# EAGLE design 237_thermopile (EAGLE 9.6.2)
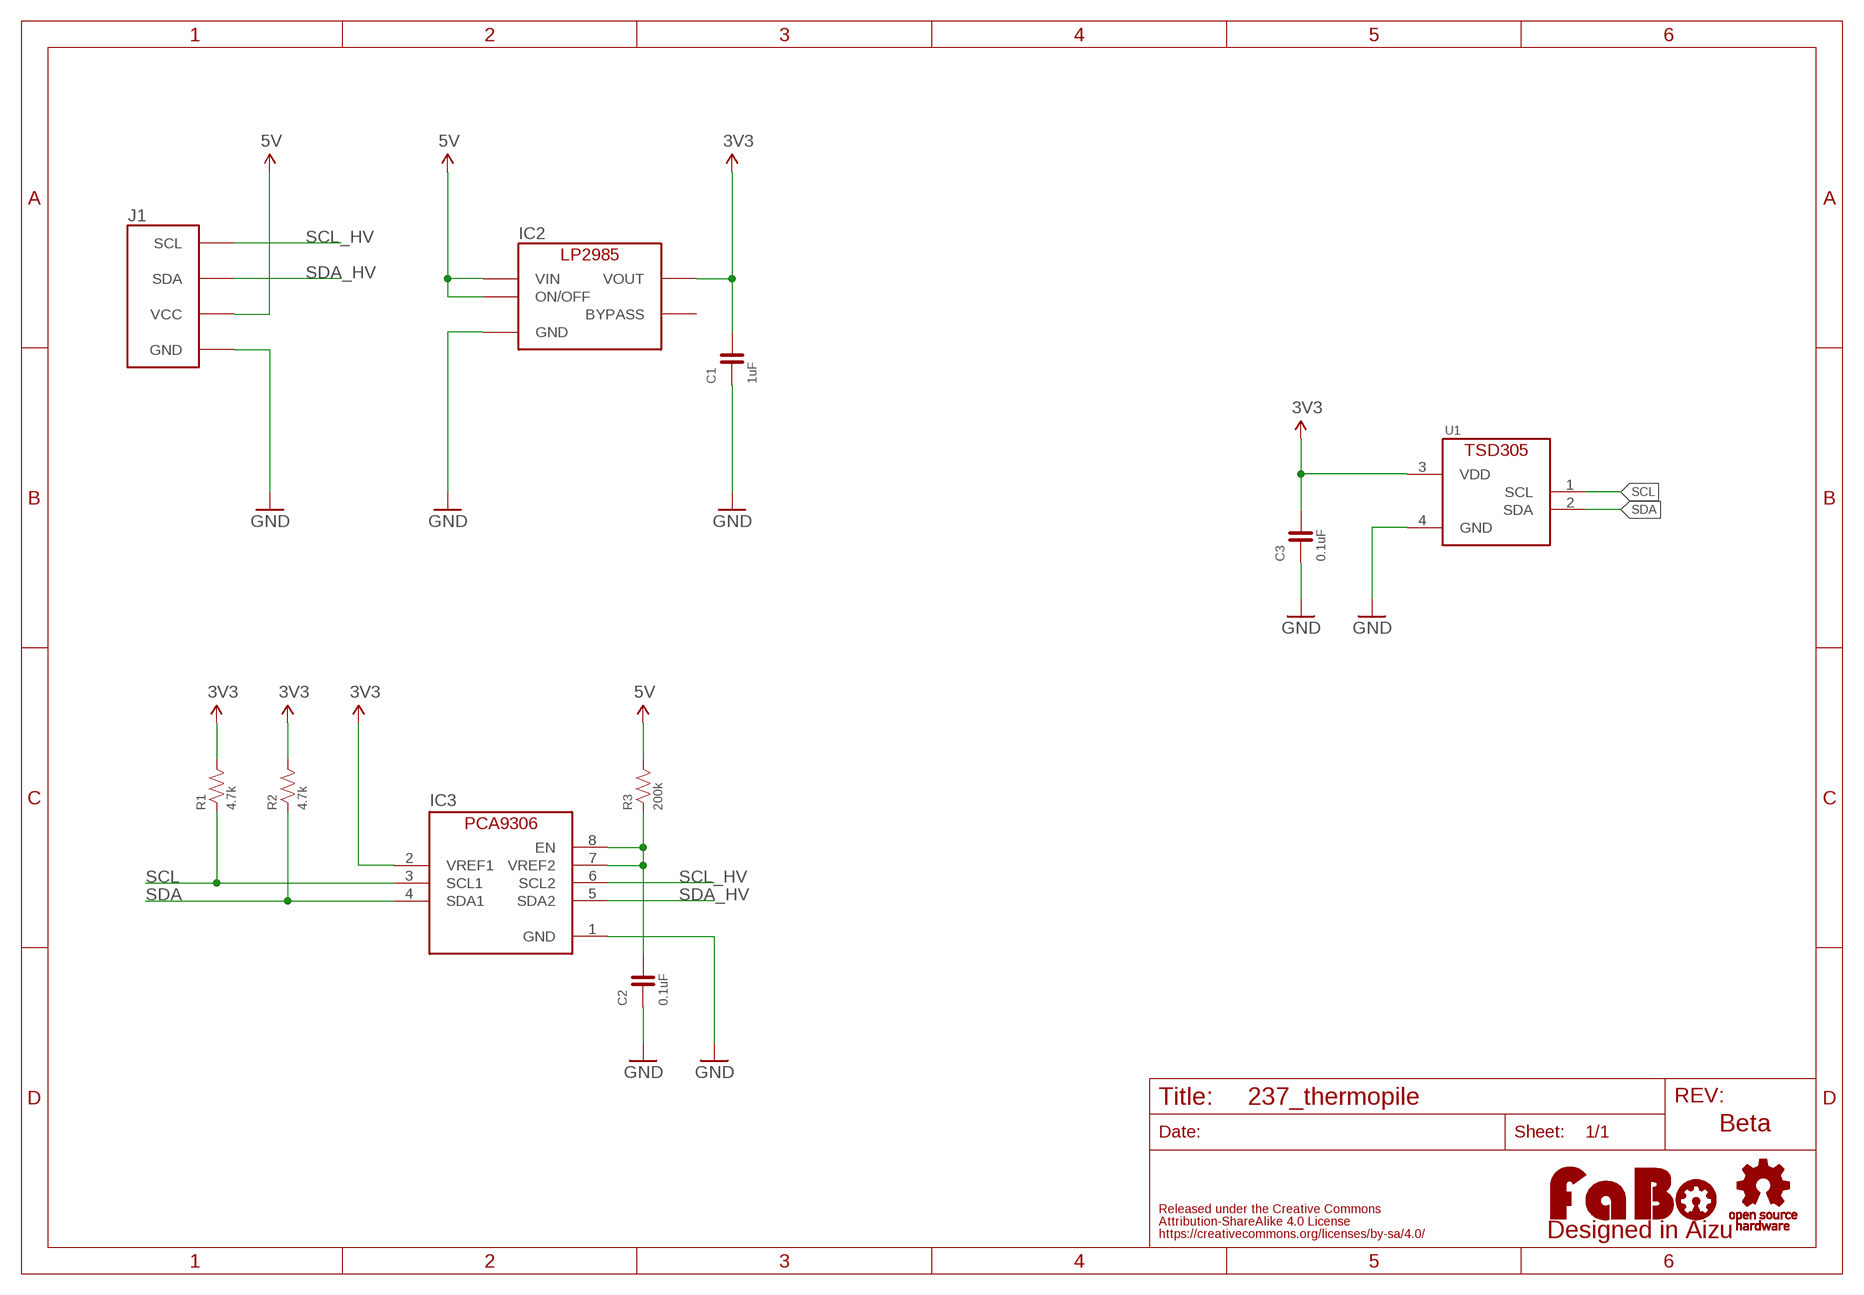
[diagram p0: schematic, sheet 1]

## Parts
C1  1uF  CAPACITOR-0603  [EIA0603]
C2  0.1uF  CAPACITOR-0603  [EIA0603]
C3  0.1uF  CAPACITOR-0603  [EIA0603]
IC2  LP2985-33DBV  [SOT-23-5]
IC3  PCA9306GM  [XQFN8]
J1  FABO_BRICK_I2C  [FABO_BRICK_I2C]
LOGO1  LOGO_FABO-M  [LOGO_FABO_M]
R1  4.7k  RESISTOR-0603  [EIA0603]
R2  4.7k  RESISTOR-0603  [EIA0603]
R3  200k  RESISTOR-0603  [EIA0603]
U1  TSD305-1C55  [TSD305]
U$2  LOGO_OSHW-M_BOTTOM  [LOGO_OSHW_M_BOTTOM]

## Nets
3V3: C1.2 C3.2 IC2.5(VOUT) IC3.2(VREF1) R1.2 R2.2 U1.3(VDD)
5V: IC2.1(VIN) IC2.3(ON/OFF) J1.VCC R3.2
GND: C1.1 C2.1 C3.1 IC2.2(GND) IC3.1(GND) J1.GND U1.4(GND)
N$1: C2.2 IC3.7(VREF2) IC3.8(EN) R3.1
SCL: IC3.3(SCL1) R1.1 U1.1(SCL)
SCL_HV: IC3.6(SCL2) J1.SCL
SDA: IC3.4(SDA1) R2.1 U1.2(SDA)
SDA_HV: IC3.5(SDA2) J1.SDA
Unconnected: IC2.4(BYPASS)

## Notes on the sheet
- Beta

## Library data of the parts
C1-C3 = component:CAPACITOR
IC2 = FaBo-Supply:LP2985: LP2985
IC3 = FaBo-LevelTranslator:PCA9306
J1 = FaBo-Template:FABO_BRICK_I2C: FaBo Brick I2C
LOGO1 = component:LOGO_FABO
R1-R3 = component:RESISTOR
U1 = component:TSD305
U$2 = FaBo-etc:LOGO_OSHW

## Board
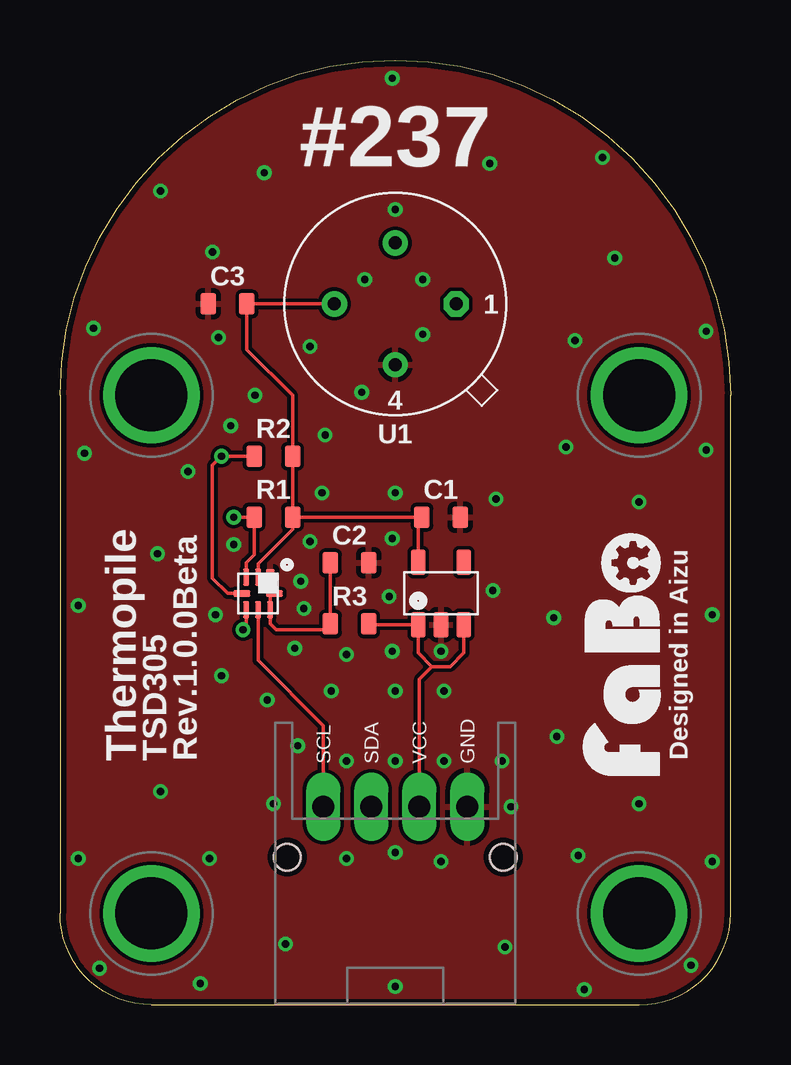
[diagram p1: board, top side]
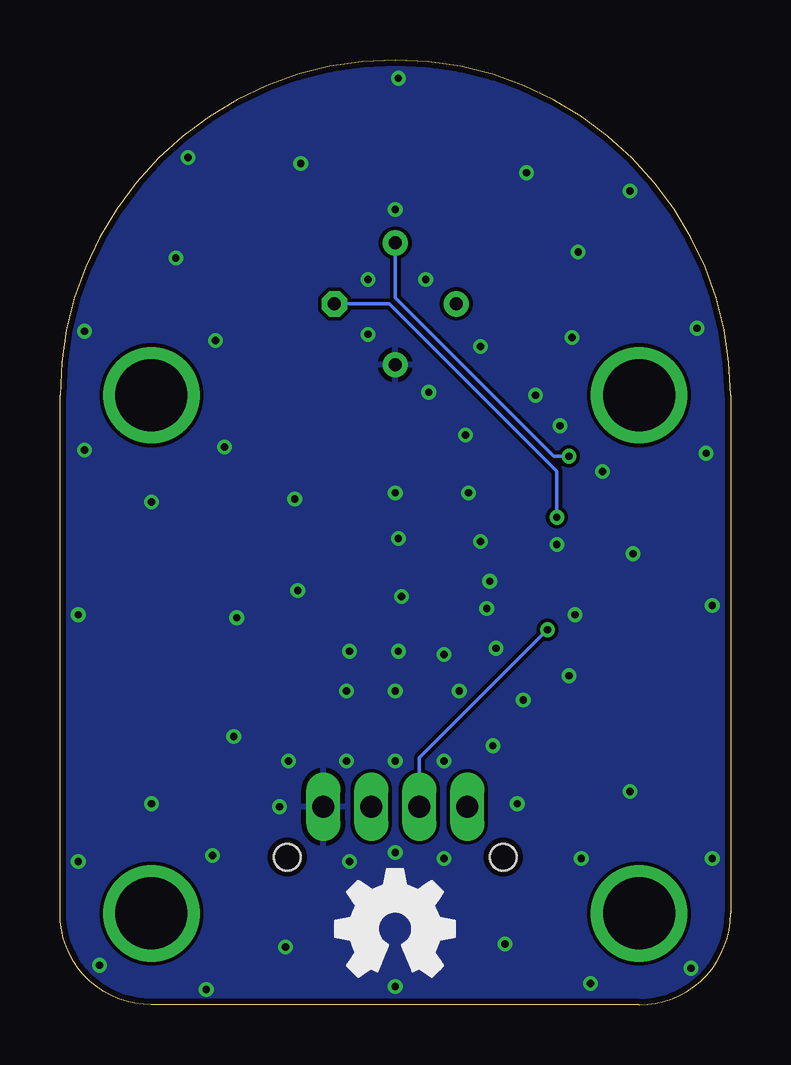
[diagram p2: board, bottom side, seen from below]

Size 27.94 x 39.37 mm. Coordinates in mm from the lower left corner, seen from the top.
Copper layers (1*16): Top 0.035mm / dielectric 1.6mm / Bottom 0.035mm
Design rules "PCBway": minimum track width 6mil, minimum drill 12mil, track to track 6mil, track to pad 6mil, pad to pad 6mil, via to via 6mil, smd to smd 6mil, copper to edge 10mil, drill to drill 10mil, minimum pad ring 10mil, minimum via ring 6mil, stop-mask expansion 2mil, vias tented up to drill 100mil, thermal gap 8mil

### Footprints (pad centres in the part's own frame; a part is rotated, then mirrored left to right if it is on the bottom)
EIA0603 = smd 0.65 x 0.9: 1 -0.8,0; 2 0.8,0
SOT-23-5 = smd 0.6 x 1.05: 1 -0.95,-1.3; 2 0,-1.3; 3 0.95,-1.3; 4 0.95,1.3; 5 -0.95,1.3
XQFN8 = smd 0.7 x 0.35: 1 -0.675,0.5 | smd 0.7 x 0.25: 2 -0.675,0; 3 -0.675,-0.5; 5 0.675,-0.5; 6 0.675,0; 7 0.675,0.5 | smd 0.25 x 0.7: 4 0,-0.675; 8 0,0.675
FABO_BRICK_I2C = drill 0.9 pad 1.422 long: GND 3,-10.795; SCL -3,-10.795; SDA -1,-10.795; VCC 1,-10.795 | drill 3 pad 3.81: P$1 -10.16,6.35; P$2 10.16,6.35; P$3 -10.16,-15.24; P$4 10.16,-15.24 | hole 1.1: -4.5,-12.895; 4.5,-12.895
TSD305 = drill 0.55 octagon: 1 2.54,0 | drill 0.55: 2 0,2.54; 3 -2.54,0; 4 0,-2.54

### Placement (x,y rotation side)
C1  15.88,20.32 180 top
C2  12.06,18.41 180 top
C3  6.99,29.21 0 top
IC2  15.88,17.14 0 top
IC3  8.26,17.14 270 top
J1  13.97,19.05 0 top
LOGO1  25.4,14.61 90 top
R1  8.89,20.32 0 top
R2  8.89,22.86 0 top
R3  12.06,15.88 0 top
U1  13.97,29.21 0 top
U$2  13.97,3.17 0 top

### Tracks (layer width: path | path; a pad name or v marks a point on that pad's centre or on a via)
3V3
  Top 0.152: IC2.5 14.93,20.32 C1.2 R1.2 | R1.2 R2.2 9.69,25.4 7.79,27.3 C3.2 U1.3 | IC3.2 8.26,18.38 9.69,19.81 R1.2
5V
  Top 0.152: 15.49,14.1 14.93,14.67 IC2.1 12.89,15.85 R3.2 | IC2.3 16.82,14.67 16.26,14.1 15.49,14.1 | J1.VCC 14.97,13.57 15.49,14.1
GND  (via drill 0.3)
  other vias: 15.88,14.73 13.84,38.61 1.4,28.19 6.6,27.81 1.02,22.99 7.11,24.13 5.33,22.23 26.92,28.07 26.92,23.11 21.46,27.69 21.08,23.24 22.61,35.31 4.19,33.91 8.51,34.67 17.91,35.05 23.11,31.11 6.35,31.37 12.7,30.23 15.11,30.23 15.11,27.94 12.57,25.53 10.41,27.43 8.13,25.4 11.05,23.75 10.92,21.34 7.24,19.18 13.97,21.34 18.16,21.08 18.03,17.27 13.72,17.02 13.84,19.43 10.41,19.3 10.03,17.65 10.16,16.51 9.78,14.86 11.94,14.61 13.84,14.73 6.48,16.26 0.76,6.1 1.65,1.52 5.84,0.89 26.29,1.65 21.84,0.64 27.18,5.97 21.59,6.22 6.22,6.1 13.97,0.76 9.4,2.54 18.54,2.41 11.94,6.1 13.97,6.35 15.88,5.97 18.8,8.26 8.89,8.38 9.91,10.79 11.94,10.16 13.97,10.16 16,10.16 18.41,10.16 16,13.08 13.97,13.08 11.3,13.08 8.64,12.7 6.73,13.72 0.76,16.64 27.18,16.26 20.57,16.13 24.13,20.95 4.19,8.89 4.06,18.8 20.7,11.18 24.13,8.38 13.97,33.15
  pour Top (isolate 0.152, rank 3): 0,0 27.94,0 27.94,39.37 0,39.37
  pour Bottom (isolate 0.152, rank 3): 0,0 27.94,0 27.94,39.37 0,39.37
N$1
  Top 0.152: IC3.8 8.76,17.14 IC3.7 8.76,15.88 9.02,15.62 11.01,15.62 R3.1 C2.2
SCL  (via drill 0.3)
  Top 0.152: v7.24,20.32 R1.1 8.09,18.76 7.75,18.42 IC3.3
  Bottom 0.152: v7.24,20.32 7.24,22.23 14.22,29.21 U1.1
SCL_HV
  Top 0.152: IC3.6 8.26,14.35 10.97,11.64 J1.SCL
SDA  (via drill 0.3)
  Top 0.152: R2.1 v6.73,22.86 6.35,22.48 6.35,17.78 6.99,17.14 IC3.4
  Bottom 0.152: v6.73,22.86 7.37,22.86 13.97,29.46 U1.2
SDA_HV  (via drill 0.3)
  Top 0.152: IC3.5 7.75,15.76 v7.63,15.63
  Bottom 0.152: v7.63,15.63 12.97,10.29 J1.SDA

### Text on the board
tPlace: #237 | Designed in Aizu | Thermopile | TSD305 | Rev.1.0.0Beta